# EAGLE design PET_AV_Interface (EAGLE 9.6.2)
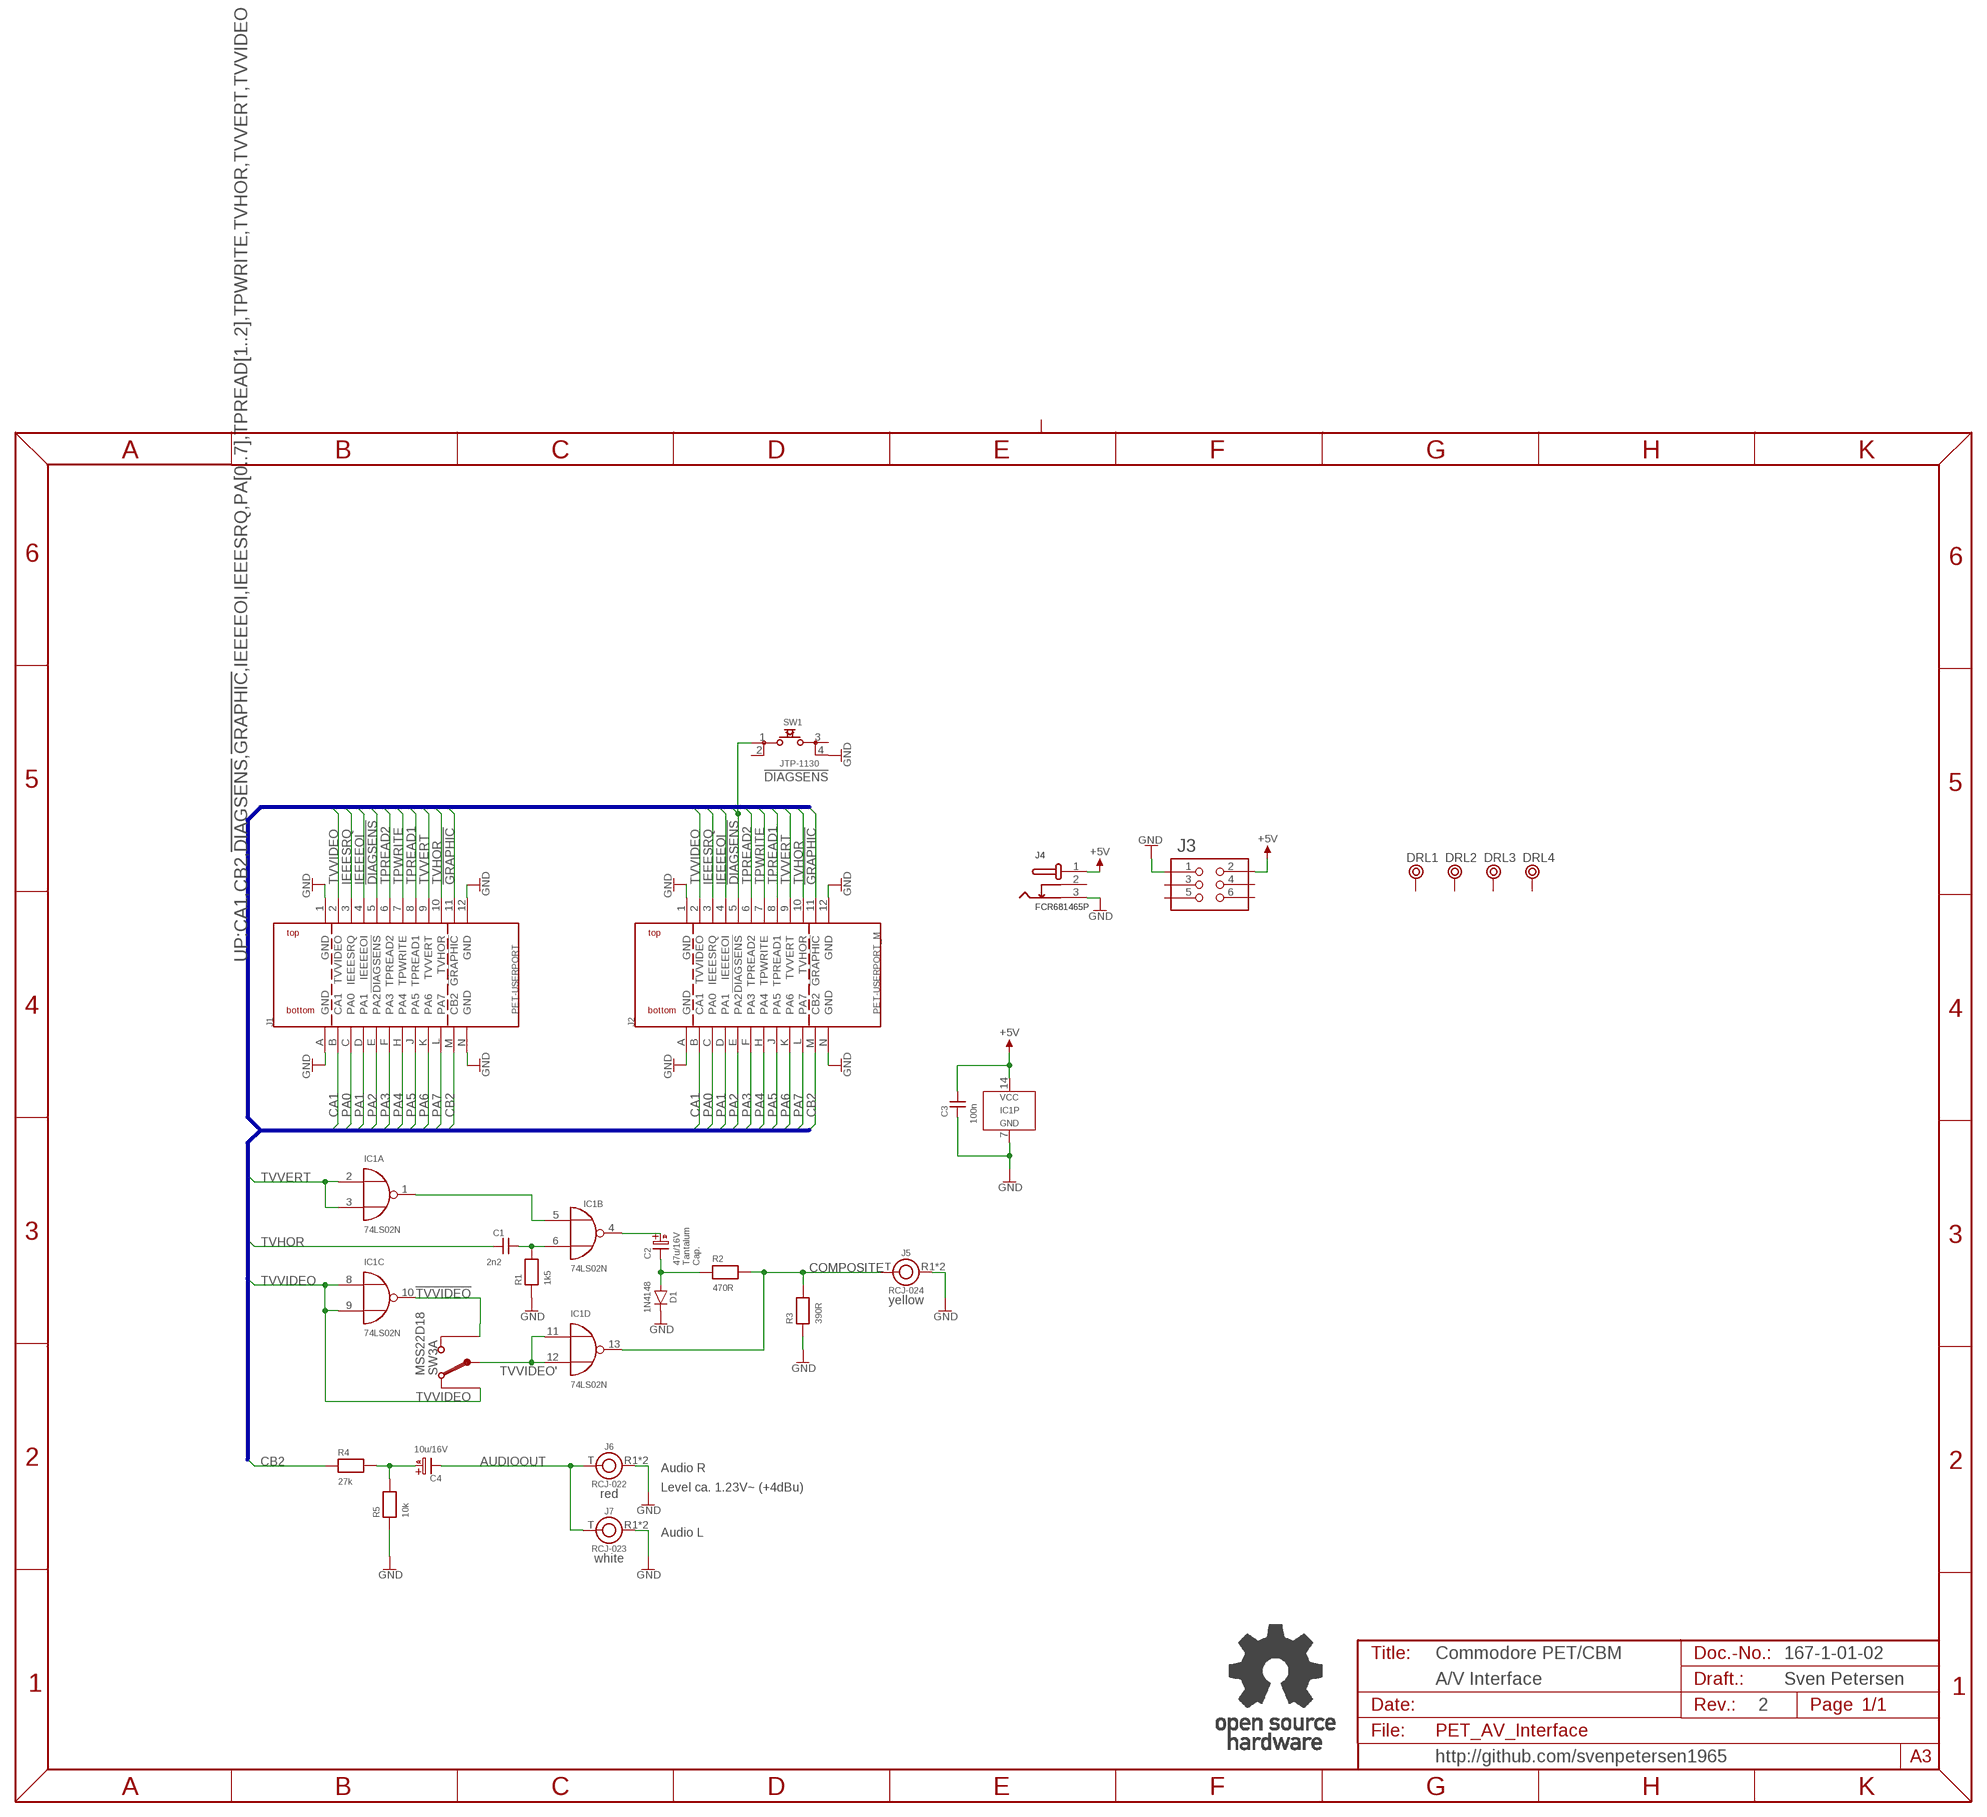
[diagram p0: schematic, sheet 1]

## Parts
C1  2n2  CAP01  [C-2,5]
C2  47u/16V  C05,0/2,0  [C5,0/2,0]
C3  100n  CAP01  [C-2,5]
C4  10u/16V  C05,0/2,0  [C5,0/2,0]
D1  1N4148  1N41480.3"  [DO-35/3]
DRL1  BOHR3,5  [BOHR3,5]
DRL2  BOHR3,5  [BOHR3,5]
DRL3  BOHR3,5  [BOHR3,5]
DRL4  BOHR3,5  [BOHR3,5]
IC1  74LS02N  7402N  [DIL-14]
J1  PET-USERPORT  [USERPORT]
J2  PET-USERPORT_M  [USERPORT_M]
J3  2X03WV  [2X03WV]
J4  FCR681465P  [FCR681465P]
J5  RCJ-024  RCJ-02X  [RCJ-02X]
J6  RCJ-022  RCJ-02X  [RCJ-02X]
J7  RCJ-023  RCJ-02X  [RCJ-02X]
R1  1k5  RES04  [R-10]
R2  470R  RES04  [R-10]
R3  390R  RES04  [R-10]
R4  27k  RES04  [R-10]
R5  10k  RES04  [R-10]
SW1  JTP-1130  [JTP-1130]
SW3  MSS22D18  DPDT_9MM  [DPDT_9MM]
U$2  OPEN_SOURCE_HW  [OPENHW]

## Nets
!DIAGSENS: J1.5(!DIAGSENS) J2.5(!DIAGSENS) SW1.1
!GRAPHIC: J1.11(!GRAPHIC) J2.11(!GRAPHIC)
!TVVERT': IC1.1(A:O) IC1.5(B:I0)
!TVVIDEO: IC1.10(C:O) SW3.1(A:UP)
+5V: C3.2 IC1.14(P:VCC) J3.2 J4.1
AUDIOOUT: C4.K(-) J6.T J7.T
CA1: J1.B(CA1) J2.B(CA1)
CB2: J1.M(CB2) J2.M(CB2) R4.1
COMPOSITE: IC1.13(D:O) J5.T R2.2 R3.2
GND: C3.1 D1.K IC1.7(P:GND) J1.1(GND) J1.12(GND) J1.A(GND) J1.N(GND) J2.1(GND) J2.12(GND) J2.A(GND) J2.N(GND) J3.1 J4.3 J5.R1(R) J5.R2(R) J6.R1(R) J6.R2(R) J7.R1(R) J7.R2(R) R1.1 R3.1 R5.1 SW1.4
IEEEEOI: J1.4(IEEEEOI) J2.4(IEEEEOI)
IEEESRQ: J1.3(IEEESRQ) J2.3(IEEESRQ)
N$1: C4.A(+) R4.2 R5.2
N$2: C1.2 IC1.6(B:I1) R1.2
N$3: C2.A(+) IC1.4(B:O)
N$4: C2.K(-) D1.A R2.1
PA0: J1.C(PA0) J2.C(PA0)
PA1: J1.D(PA1) J2.D(PA1)
PA2: J1.E(PA2) J2.E(PA2)
PA3: J1.F(PA3) J2.F(PA3)
PA4: J1.H(PA4) J2.H(PA4)
PA5: J1.J(PA5) J2.J(PA5)
PA6: J1.K(PA6) J2.K(PA6)
PA7: J1.L(PA7) J2.L(PA7)
TPREAD1: J1.8(TPREAD1) J2.8(TPREAD1)
TPREAD2: J1.6(TPREAD2) J2.6(TPREAD2)
TPWRITE: J1.7(TPWRITE) J2.7(TPWRITE)
TVHOR: C1.1 J1.10(TVHOR) J2.10(TVHOR)
TVVERT: IC1.2(A:I0) IC1.3(A:I1) J1.9(TVVERT) J2.9(TVVERT)
TVVIDEO: IC1.8(C:I0) IC1.9(C:I1) J1.2(TVVIDEO) J2.2(TVVIDEO) SW3.3(A:DWN)
TVVIDEO': IC1.11(D:I0) IC1.12(D:I1) SW3.2(A:COM)
Unconnected: DRL1.P$1 DRL2.P$1 DRL3.P$1 DRL4.P$1 J3.3 J3.4 J3.5 J3.6 J4.2 SW1.2 SW1.3 SW3.4(B:DWN) SW3.5(B:COM) SW3.6(B:UP)

## Buses
UP:CA1,CB2,!DIAGSENS,!GRAPHIC,IEEEEOI,IEEESRQ,PA[0..7],TPREAD[1..2],TPWRITE,TVHOR,TVVERT,TVVIDEO

## Notes on the sheet
- Tantalum
  Cap.
- yellow
- Audio R
- Level ca. 1.23V~ (+4dBu)
- red
- Audio L
- white
- Commodore PET/CBM | 167-1-01-02
- A/V Interface | Sven Petersen
- 2
- http://github.com/svenpetersen1965

## Library data of the parts
C1 C3 = DISCRETE:CAP01
C2 C4 = ELCO:C05,0/2,0
D1 = Dioden:1N4148
DRL1-DRL4 = Mech_Bohr:BOHR3,5
IC1 = 74XXsmd:7402
J1 J2 = Commodore:PET-USERPORT
J3 = PINHEAD:2X03WV
J4 = Cliff:FCR681465P
J5-J7 = CUI_INC:RCJ-02X
R1-R5 = DISCRETE:RES04
SW1 = Namae_Electronics:JTP-1130
SW3 = switches:DPDT_9MM
U$2 = Logo:OPEN_SOURCE_HW

## Board
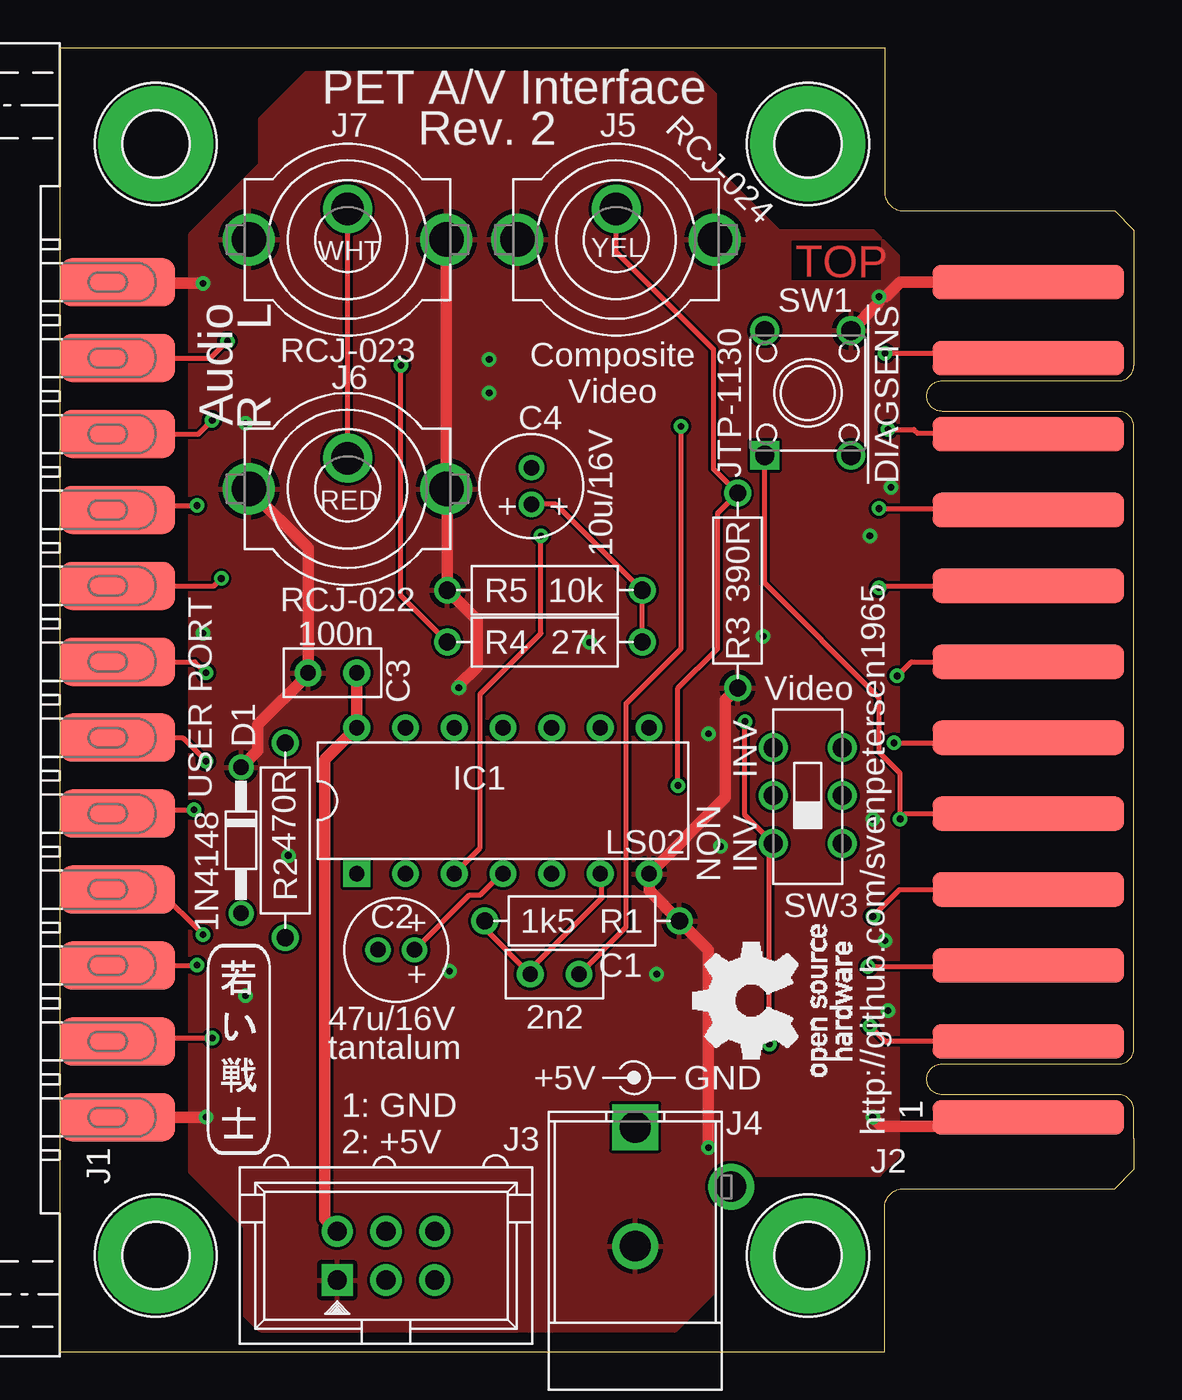
[diagram p1: board, top side]
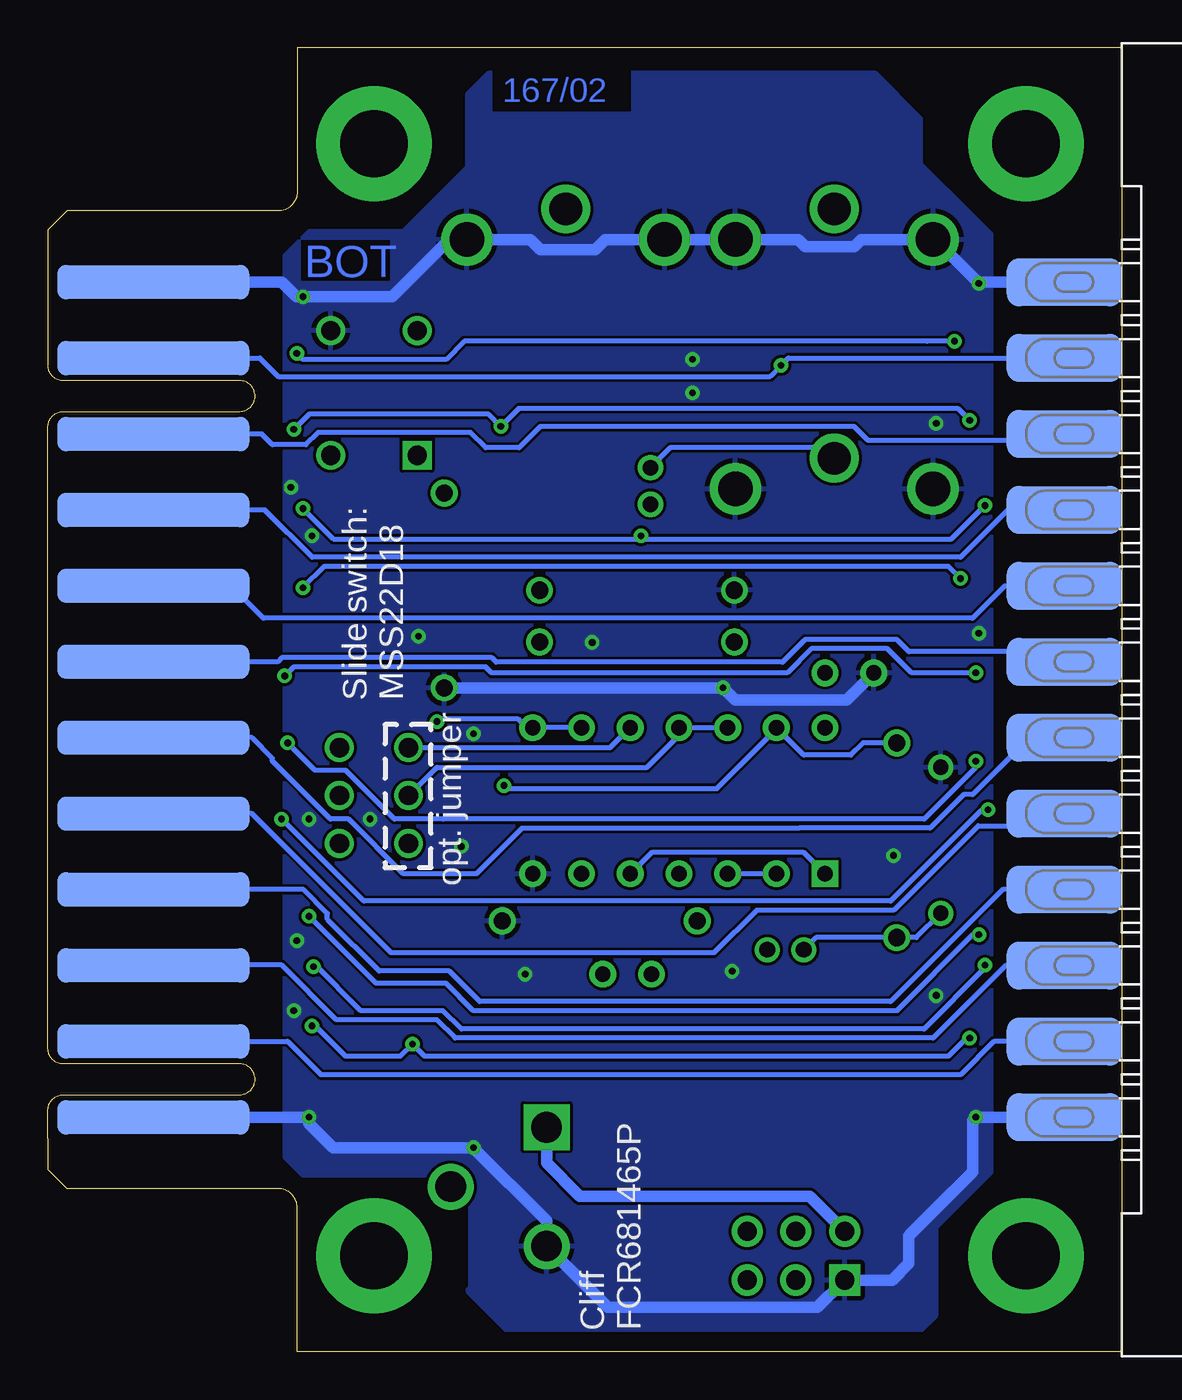
[diagram p2: board, bottom side, seen from below]

Size 56 x 68 mm. Coordinates in mm from the lower left corner, seen from the top.
Outline: 44,59.5 arc-90 43,60.5 43,68 0,68 0,0 43,0 43,7.5 arc-90 44,8.5
Copper layers (1*16): Top 0.035mm / dielectric 1.5mm / Bottom 0.035mm
Design rules "default *": minimum track width 6mil, minimum drill 0.35mm, track to track 6mil, track to pad 6mil, pad to pad 6mil, via to via 6mil, smd to smd 6mil, copper to edge 40mil, drill to drill 6mil, minimum pad ring 10mil, minimum via ring 8mil, stop-mask expansion 4mil, vias tented up to drill 25mil, thermal gap 10mil
bRestrict: 3 lines

### Footprints (pad centres in the part's own frame; a part is rotated, then mirrored left to right if it is on the bottom)
C-2,5 = drill 0.8 pad 1.397: 1 -1.27,0; 2 1.27,0
C5,0/2,0 = drill 0.813 pad 1.27: A -0.953,0; K 0.953,0
DO-35/3 = drill 0.8: A -3.81,0; K 3.81,0
BOHR3,5 = drill 3.5 pad 6: P$1 0,0
DIL-14 = drill 0.8 pad 1.397 square: 1 -7.62,-3.81 | drill 0.8 pad 1.397: 2 -5.08,-3.81; 3 -2.54,-3.81; 4 0,-3.81; 5 2.54,-3.81; 6 5.08,-3.81; 7 7.62,-3.81; 8 7.62,3.81; 9 5.08,3.81; 10 2.54,3.81; 11 0,3.81; 12 -2.54,3.81; 13 -5.08,3.81; 14 -7.62,3.81
USERPORT = smd 2.5 x 6: 1 -21.78,-3; 2 -17.82,-3; 3 -13.86,-3; 4 -9.9,-3; 5 -5.94,-3; 6 -1.98,-3; 7 1.98,-3; 8 5.94,-3; 9 9.9,-3; 10 13.86,-3; 11 17.82,-3; 12 21.78,-3 | smd 2.5 x 6 bottom: A -21.78,-3; B -17.82,-3; C -13.86,-3; D -9.9,-3; E -5.94,-3; F -1.98,-3; H 1.98,-3; J 5.94,-3; K 9.9,-3; L 13.86,-3; M 17.82,-3; N 21.78,-3
USERPORT_M = smd 1.8 x 10: 1 -21.78,5.5; 2 -17.82,5.5; 3 -13.86,5.5; 4 -9.9,5.5; 5 -5.94,5.5; 6 -1.98,5.5; 7 1.98,5.5; 8 5.94,5.5; 9 9.9,5.5; 10 13.86,5.5; 11 17.82,5.5; 12 21.78,5.5 | smd 1.8 x 10 bottom: A -21.78,5.5; B -17.82,5.5; C -13.86,5.5; D -9.9,5.5; E -5.94,5.5; F -1.98,5.5; H 1.98,5.5; J 5.94,5.5; K 9.9,5.5; L 13.86,5.5; M 17.82,5.5; N 21.78,5.5
2X03WV = drill 1 pad 1.626 square: 1 -2.54,-1.27 | drill 1 pad 1.626: 2 -2.54,1.27; 3 0,-1.27; 4 0,1.27; 5 2.54,-1.27; 6 2.54,1.27
FCR681465P = drill 1.6 square: 1 0,13.7 | drill 1.6: 2 5,10.6; 3 0,7.5
RCJ-02X = drill 1.8 pad 2.54: R1 -5.15,0; R2 5.15,0 | drill 1.7 pad 2.5: T 0,1.6
R-10 = drill 0.889 pad 1.397: 1 -5.08,0; 2 5.08,0
JTP-1130 = drill 1 square: 1 3.25,-2.25 | drill 1: 2 -3.25,-2.25; 3 3.25,2.25; 4 -3.25,2.25
DPDT_9MM = drill 1: 1 -1.8,2.5; 2 -1.8,0; 3 -1.8,-2.5; 4 1.8,-2.5; 5 1.8,0; 6 1.8,2.5

### Placement (x,y rotation side)
C1  25.8,19.68 180 top
C2  17.54,20.95 180 top
C3  14.21,35.4 0 top
C4  24.58,45.15 90 top
D1  9.45,26.67 90 top
DRL1  5,5 0 top
DRL2  39,5 0 top
DRL3  39,63 0 top
DRL4  5,63 0 top
IC1  23.1,28.73 0 top
J1  0,34 90 top
J2  56,34 90 top
J3  17,5 0 top
J4  30,-2 0 top
J5  29,58 0 top
J6  15,45 0 top
J7  15,58 0 top
R1  27.23,22.46 180 top
R2  11.75,26.67 90 top
R3  35.34,39.7 90 top
R4  25.29,37.01 0 top
R5  25.29,39.71 0 top
SW1  39,50 270 top
SW3  39,29 0 top
U$2  41.27,14.37 90 top
U$22  [PCB-TITLE/]  -0.08,86.44 0 top  (outside the outline)
U$23  [2LAYER]  38.34,56.04 0 top
U$26  [SVEN_TAG]  9.37,15.88 0 top

### Tracks (layer width: path | path; a pad name or v marks a point on that pad's centre or on a via)
!DIAGSENS  (via drill 0.35)
  Top 0.254: J1.5 3.16,28.22 6.95,28.22 v6.99,28.26 | J2.5 44.09,28.06 v43.81,27.78 43.81,30.16 42.7,31.27 42.7,34.13 36.75,40.08 SW1.1
  Bottom 0.254: v6.99,28.26 7.3,28.26 12.06,23.5 39.53,23.5 v43.81,27.78
!GRAPHIC  (via drill 0.35)
  Top 0.254: J1.11 7.85,51.82 v8.73,52.7 | v43.02,52.07 50.25,52.07 J2.11
  Bottom 0.254: v8.73,52.7 10.16,52.7 34.29,52.7 35.24,51.75 42.7,51.75 v43.02,52.07
!TVVERT'
  Bottom 0.254: IC1.1 16.59,26.04 24.53,26.04 IC1.5
!TVVIDEO
  Bottom 0.254: SW3.1 26.68,31.5 IC1.10
+5V
  Top 0.61: J3.2 13.81,6.92 13.81,30.88 IC1.14 15.48,35 15.4,35.08 15.4,35.32 C3.2
  Bottom 0.61: J3.2 16.29,8.1 28.26,8.1 30,9.84 J4.1
AUDIOOUT
  Top 0.254: J6.T J7.T
  Bottom 0.254: J6.T 15.55,47.15 23.54,47.15 C4.K
CA1
  Bottom 0.254: J1.B 6.68,16.18 8.41,14.45 41.75,14.45 43.5,16.19 43.51,16.18 J2.B
CB2  (via drill 0.35)
  Top 0.254: R4.1 17.78,39.44 v17.78,51.44
  Bottom 0.254: J1.M 17.39,51.82 v17.78,51.44 18.35,50.87 43.99,50.87 44.94,51.82 J2.M
COMPOSITE  (via drill 0.35)
  Top 0.254: v32.23,29.53 32.23,34.61 34.29,36.67 34.29,43.74 R3.2 34.07,46.05 34.07,52.29 29,57.36 J5.T
  Bottom 0.254: v32.23,29.53 32.07,29.37 21.11,29.37 18.02,32.46 IC1.13 16.59,31.11 14.13,31.11 13.49,31.75 R2.2
GND  (via drill 0.35)
  Top 0.254: 45.72,11.75 50.03,11.75 J2.A
  Top 0.61: J1.A v7.62,12.22 | v7.46,55.72 3.06,55.72 J1.N | J2.N 43.81,55.78 43.06,55.02 v42.7,55.02 42.7,54.7 SW1.4 | v42.39,12.22 42.86,11.75 45.72,11.75 | J7.R2 J6.R2 20.2,44.95 R5.1 21.75,38.17 21.75,35.72 20.8,34.77 v20.8,34.62 | v33.81,10.64 33.81,20.95 R1.1 30.72,24.05 IC1.7 34.7,28.91 34.7,33.99 R3.1 | v20.8,34.62 20.8,34.61 v20.8,34.62 | D1.K 10.32,31.35 10.32,32.7 12.94,35.32 C3.1 12.94,41.91 J6.R1
  Bottom 0.61: J1.A v7.62,12.22 7.78,12.06 7.78,9.37 11.11,6.03 11.11,4.6 11.99,3.73 J3.1 15.89,2.3 26.8,2.3 J4.3 30,6.82 v33.81,10.64 41.12,10.64 42.39,11.91 v42.39,12.22 | J1.N 7.4,55.78 v7.46,55.72 9.74,58 J7.R1 13.6,58 13.97,57.63 16.51,57.63 16.88,58 J7.R2 J5.R1 26.93,58 27.46,57.47 30.32,57.47 30.85,58 J5.R2 35.08,58 38.06,55.02 v42.7,55.02 43.05,55.02 43.81,55.78 J2.N | J2.A v42.39,12.22 | v42.39,12.22 | R3.1 v20.8,34.62 20.16,33.99 14.35,33.99 C3.1
  other vias: 20.32,19.84 31.11,19.68 34.45,26.35 43.18,17.78 11.91,25.88 39.21,27.78 27.62,36.99 36.67,37.31 7.46,37.47 22.38,50.01 22.38,51.75 43.02,21.43 33.81,32.23 42.23,42.55 43.34,45.09 9.68,48.42 42.39,27.78 9.68,18.57
  pour Bottom: 6.83,10 6.83,58.26 7.94,59.37 10.48,61.91 10.48,64.29 12.86,66.67 33.02,66.67 34.13,65.56 34.13,61.75 37.47,58.42 42.39,58.42 43.66,57.15 43.66,54.45 43.66,10.16 42.7,9.21 35.08,9.21 33.97,8.1 33.97,3.33 34.13,3.17 32.07,1.11 10.48,1.11 9.68,1.91 9.68,6.51 6.83,9.37
  pour Top: 6.83,58.26 10.48,61.91 10.48,64.29 12.86,66.67 33.02,66.67 34.13,65.56 34.13,61.75 37.47,58.42 42.39,58.42 43.66,57.15 43.66,10.16 42.7,9.21 35.08,9.21 33.97,8.1 33.97,3.02 32.07,1.11 10.48,1.11 9.68,1.91 9.68,6.51 6.83,9.37
IEEEEOI  (via drill 0.35)
  Top 0.254: J1.4 5.11,24.1 v7.46,21.75 | v42.39,22.7 43.78,24.1 J2.4
  Bottom 0.254: v7.46,21.75 7.78,21.75 11.75,17.78 33.81,17.78 35.24,19.21 38.89,19.21 40.16,20.48 v42.39,22.7
IEEESRQ  (via drill 0.35)
  Top 0.254: J1.3 7.12,20.14 v7.14,20.16 | v42.15,20.08 50.44,20.08 J2.3
  Bottom 0.254: v7.14,20.16 7.14,20 10.32,16.83 34.45,16.83 35.4,17.78 39.69,17.78 42.07,20.16 v42.15,20.08
N$1
  Top 0.254: R4.2 R5.2 30.34,39.71 25.85,44.2 C4.A
N$2
  Top 0.254: R1.2 22.15,22.07 C1.2 24.53,19.92 28.26,23.65 28.26,24.84 IC1.6
N$3
  Top 0.254: C2.A 21.35,23.81 21.91,23.81 23.02,24.92 IC1.4
N$4
  Bottom 0.254: D1.A 10.72,21.59 R2.1 15.95,21.59 C2.K
PA0
  Bottom 0.254: J1.C 6.05,20.14 9.84,16.35 34.77,16.35 35.72,17.3 40.96,17.3 43.81,20.16 50.48,20.16 J2.C
PA1
  Bottom 0.254: J1.D 6.22,24.1 12.06,18.26 33.5,18.26 35.08,19.84 38.73,19.84 41.43,22.54 41.43,22.86 42.67,24.1 J2.D
PA2
  Bottom 0.254: J1.E 3.63,27.43 7.5,27.43 11.91,23.02 19.05,23.02 21.27,20.8 38.1,20.8 45.36,28.06 J2.E
PA3
  Bottom 0.254: J1.F 4.81,32.02 7.78,29.05 8.26,29.05 10,27.3 16.83,27.3 31.27,27.3 33.66,24.92 37.47,24.92 40.32,27.78 41.27,27.78 44.29,30.8 44.29,30.96 45.35,32.02 J2.F
PA4
  Bottom 0.254: J1.H 3.53,36.51 11.11,36.51 11.75,37.15 16.51,37.15 17.69,35.97 32.63,35.97 32.86,36.2 43.81,36.2 44.03,35.98 J2.H
PA5
  Bottom 0.254: J1.J 6.1,39.94 7.78,38.26 44.77,38.26 46.45,39.94 J2.J
PA6
  Bottom 0.254: J1.K 5.95,43.9 8.41,41.43 42.23,41.43 44.69,43.9 J2.K
PA7
  Bottom 0.254: J1.L 3.32,47.54 13.25,47.54 13.97,48.26 30.32,48.26 31.43,47.15 33.18,47.15 33.97,47.94 41.91,47.94 42.55,47.31 44.29,47.31 44.84,47.86 J2.L
TPREAD1  (via drill 0.35)
  Top 0.254: J1.8 8.03,39.94 v8.41,40.32 | v42.7,39.85 42.8,39.94 J2.8
  Bottom 0.254: v8.41,40.32 9.05,40.96 41.59,40.96 v42.7,39.85
TPREAD2  (via drill 0.35)
  Top 0.254: J1.6 6.4,32.02 v7.62,30.8 | v43.5,31.75 50.23,31.75 J2.6
  Bottom 0.254: v7.62,30.8 7.62,30.48 10.32,27.78 35.4,27.78 37.94,27.78 40.48,30.32 42.07,30.32 v43.5,31.75
TPWRITE  (via drill 0.35)
  Top 0.254: J1.7 7.04,35.98 v7.62,35.4 | v43.66,35.24 44.39,35.98 J2.7
  Bottom 0.254: v7.62,35.4 10.95,35.4 12.22,36.67 16.19,36.67 17.46,35.4 32.86,35.4 33.18,35.72 43.18,35.72 v43.66,35.24
TVHOR  (via drill 0.35)
  Top 0.254: C1.1 29.53,22.15 29.53,33.81 32.38,36.67 v32.38,48.26 | J1.10 7.22,47.86 v7.94,48.58 | v43.18,48.1 44.52,48.1 44.73,47.9 50.46,47.9 J2.10
  Bottom 0.254: v7.94,48.58 8.57,49.21 31.43,49.21 v32.38,48.26 33.02,48.9 42.39,48.9 v43.18,48.1
TVVERT  (via drill 0.35)
  Top 0.254: IC1.3 21.91,26.27 21.91,34.29 25.08,37.47 25.08,42.23 24.92,42.39 v25.08,42.55 | J1.9 3.23,44.13 v7.14,44.13 | v42.7,43.97 50.43,43.97 J2.9
  Bottom 0.254: IC1.2 IC1.3 | v7.14,44.13 8.89,42.39 24.92,42.39 v25.08,42.55 25.24,42.39 41.12,42.39 v42.7,43.97
TVVIDEO  (via drill 0.35)
  Top 0.254: J1.2 3.17,16.35 v7.94,16.35 | v42.23,16.99 43.07,16.14 43.11,16.18 J2.2 | v36.99,16.03 36.99,26.29 SW3.3 35.72,27.98 v35.72,32.86
  Bottom 0.254: v7.94,16.35 8.1,16.35 9.05,15.4 36.35,15.4 v36.99,16.03 37.62,15.4 40.48,15.4 42.07,16.99 v42.23,16.99 | IC1.9 IC1.8 31.04,32.54 31.51,33.02 35.56,33.02 v35.72,32.86
TVVIDEO'
  Bottom 0.254: SW3.2 35.72,30.48 24.77,30.48 23.1,32.15 IC1.11 IC1.12

### Text on the board
Bottom: 167/02
tPlace: PET A/V Interface | Rev. 2 | !DIAGSENS | LS02 | +5V | GND | http://github.com/svenpetersen1965 | 1: GND / 2: +5V
tNames: WHT | YEL | L | Audio | R | Composite / Video | RED | USER PORT | Video | INV | NON / INV | tantalum
bNames: Slide switch: / MSS22D18 | opt. jumper | Cliff / FCR681465P
Document: 167-2-01-02 | Sven Petersen / 2023 | 35µm | 2 | 2